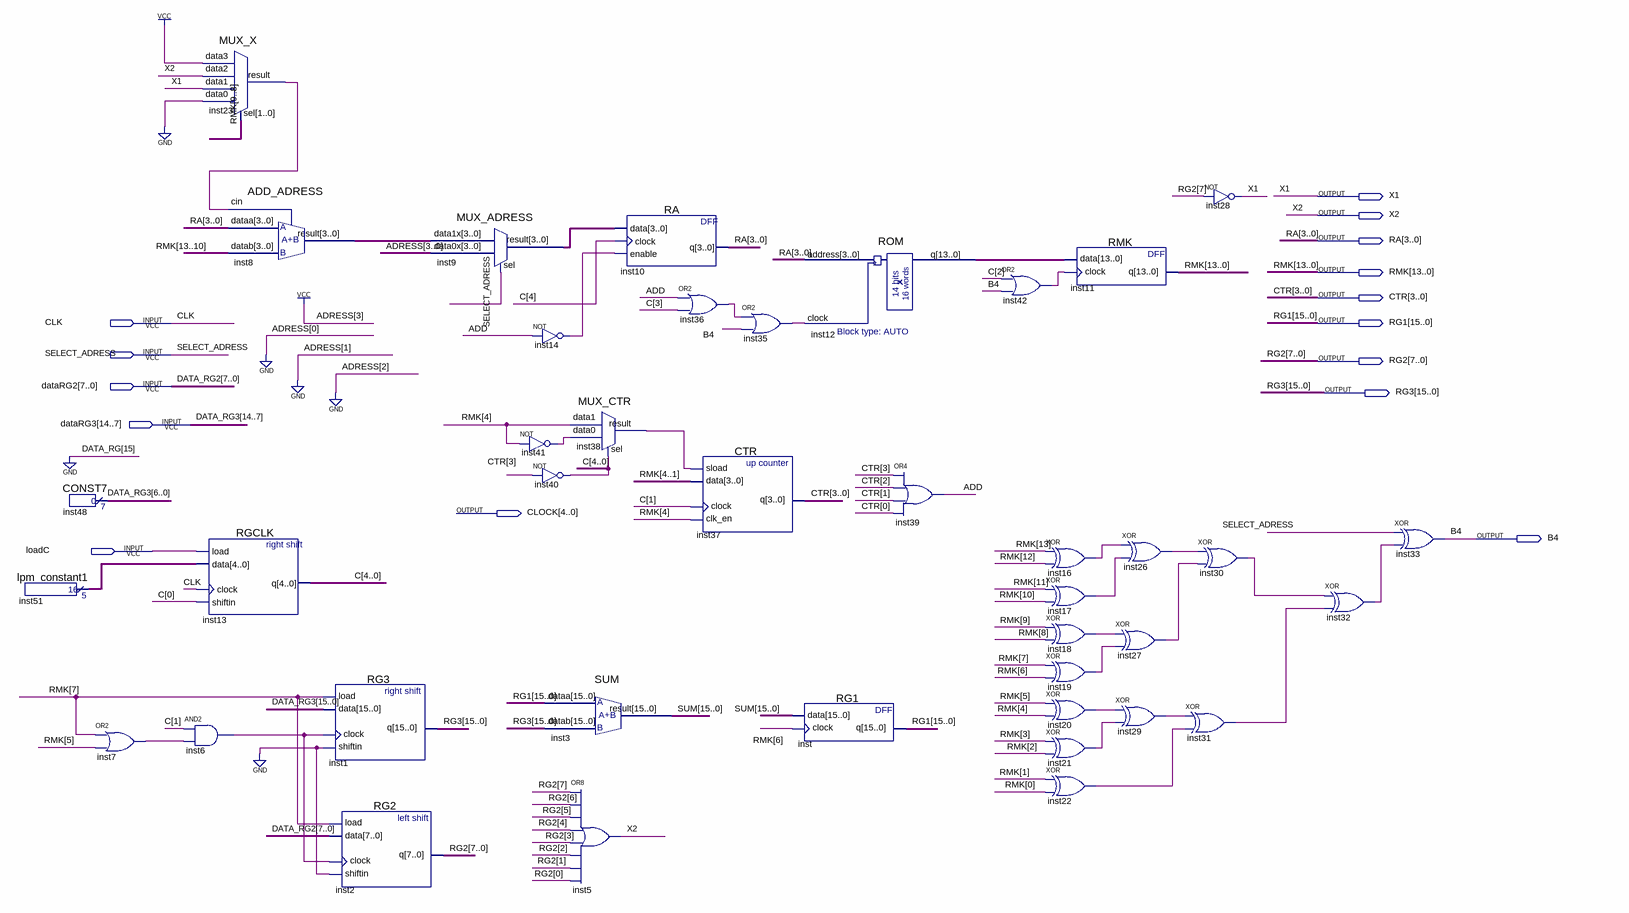
[diagram p0: schematic sheet]
// Quartus schematic LAB.bdf as structural Verilog: 40 symbols, 15 pins
module LAB (
  input  CLK,
  input  SELECT_ADRESS,
  input  [7:0] dataRG2,
  input  [14:7] dataRG3,
  input  loadC,
  output X1,
  output X2,
  output [3:0] RA,
  output [13:0] RMK,
  output [3:0] CTR,
  output [15:0] RG1,
  output [7:0] RG2,
  output [15:0] RG3,
  output [4:0] CLOCK,
  output B4
);

  wire ADD, inst6_out, inst7_out, inst14_out, inst16_out, inst17_out, inst18_out, inst19_out, inst20_out,
       inst21_out, inst22_out, inst23_result, inst26_out, inst27_out, inst29_out, inst30_out, inst31_out,
       inst32_out, inst35_out, inst36_out, inst38_result, inst40_out, inst41_out, inst42_out;
  wire [3:0] inst8_result, inst9_result;
  wire [4:0] C, inst51_result;
  wire [13:0] inst12_q;
  wire [15:0] DATA_RG3, SUM;

  lpm_constant1 inst51 (.result(inst51_result));
  CONST7 inst48 (.result(DATA_RG3[6:0]));
  or inst7 (inst7_out, RMK[7], RMK[5]);
  MUX_X inst23 (.data3(1'b1), .data2(X2), .data1(X1), .data0(1'b0), .sel(RMK[9:8]), .result(inst23_result));
  RGCLK inst13 (.load(loadC), .data(inst51_result), .clock(CLK), .shiftin(C[0]), .q(C));
  and inst6 (inst6_out, C[1], inst7_out);
  ADD_ADRESS inst8 (.dataa(RA), .datab(RMK[13:10]), .cin(inst23_result), .result(inst8_result));
  RG3 inst1 (.load(RMK[7]), .data({DATA_RG3[15], dataRG3, DATA_RG3[6:0]}), .clock(inst6_out), .shiftin(1'b0), .q(RG3));
  RG2 inst2 (.load(RMK[7]), .data(dataRG2), .clock(inst6_out), .shiftin(1'b0), .q(RG2));
  MUX_ADRESS inst9 (.data1x(inst8_result), .data0x(4'b1000), .sel(SELECT_ADRESS), .result(inst9_result));
  not inst14 (inst14_out, ADD);
  not inst41 (inst41_out, RMK[4]);
  not inst40 (inst40_out, CTR[3]);
  SUM inst3 (.dataa(RG1), .datab(RG3), .result(SUM));
  MUX_CTR inst38 (.data1(RMK[4]), .data0(inst41_out), .sel(inst40_out), .result(inst38_result));
  or inst5 (X2, RG2[7], RG2[6], RG2[5], RG2[4], RG2[3], RG2[2], RG2[1], RG2[0]);
  RA inst10 (.data(inst9_result), .clock(C[4]), .enable(inst14_out), .q(RA));
  or inst36 (inst36_out, ADD, C[3]);
  CTR inst37 (.sload(inst38_result), .data(RMK[4:1]), .clock(C[1]), .clk_en(RMK[4]), .q(CTR));
  or inst35 (inst35_out, inst36_out, B4);
  ROM inst12 (.address(RA), .clock(inst35_out), .q(inst12_q));
  RG1 inst (.data(SUM), .clock(RMK[6]), .q(RG1));
  or inst39 (ADD, CTR[3], CTR[2], CTR[1], CTR[0]);
  or inst42 (inst42_out, C[2], B4);
  RMK inst11 (.data(inst12_q), .clock(inst42_out), .q(RMK));
  xor inst16 (inst16_out, RMK[13], RMK[12]);
  xor inst17 (inst17_out, RMK[11], RMK[10]);
  xor inst18 (inst18_out, RMK[9], RMK[8]);
  xor inst19 (inst19_out, RMK[7], RMK[6]);
  xor inst20 (inst20_out, RMK[5], RMK[4]);
  xor inst21 (inst21_out, RMK[3], RMK[2]);
  xor inst22 (inst22_out, RMK[1], RMK[0]);
  xor inst27 (inst27_out, inst18_out, inst19_out);
  xor inst29 (inst29_out, inst20_out, inst21_out);
  xor inst26 (inst26_out, inst16_out, inst17_out);
  not inst28 (X1, RG2[7]);
  xor inst30 (inst30_out, inst26_out, inst27_out);
  xor inst31 (inst31_out, inst29_out, inst22_out);
  xor inst32 (inst32_out, inst30_out, inst31_out);
  xor inst33 (B4, SELECT_ADRESS, inst32_out);

  // Other names for the same wires on the sheet: DATA_RG2[7:0] = dataRG2; DATA_RG3[14:7] = dataRG3
endmodule
